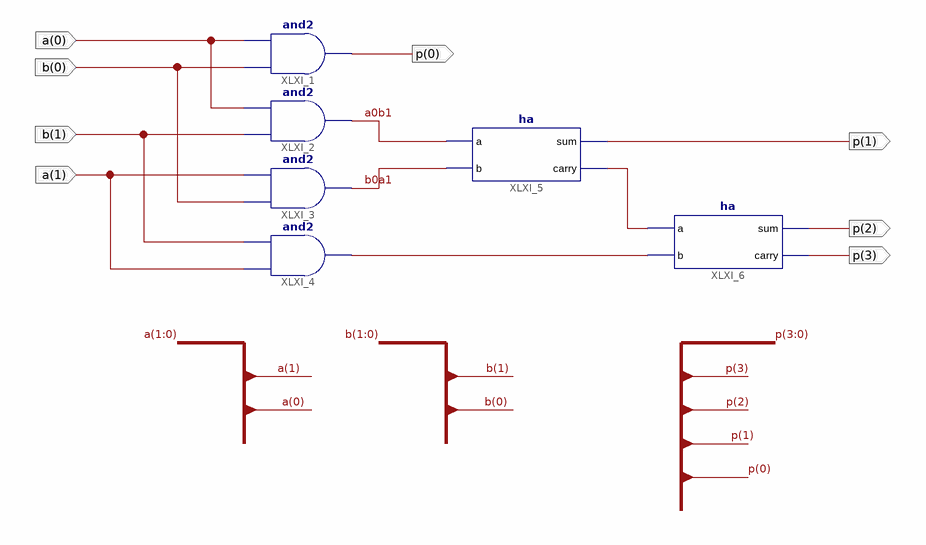
[diagram p0: schematic sheet 1]
// Xilinx ISE schematic mymul22.sch (xc9500) as structural Verilog: 6 symbols, 8 ports
module mymul22 (
  input  [1:0] a,
  input  [1:0] b,
  output [3:0] p
);

  wire a0b1, b0a1, XLXN_13, XLXN_14;

  and XLXI_1 (p[0], b[0], a[0]);
  and XLXI_2 (a0b1, b[1], a[0]);
  and XLXI_3 (b0a1, b[0], a[1]);
  and XLXI_4 (XLXN_13, a[1], b[1]);
  ha XLXI_5 (.a(a0b1), .b(b0a1), .sum(p[1]), .carry(XLXN_14));
  ha XLXI_6 (.a(XLXN_14), .b(XLXN_13), .sum(p[2]), .carry(p[3]));
endmodule
